# Altium schematic sheet DM3370_Connector_C.SchDoc: =project_title
size Tabloid; CompanyName: Luxonis Holding; Organization: Luxonis Holding; Address1: 1925 Harmony Park Drive; Address2: Westminster, CO; Address3: 80234; Address4: United States; DocumentNumber: 6; SheetNumber: 6; SheetTotal: 17
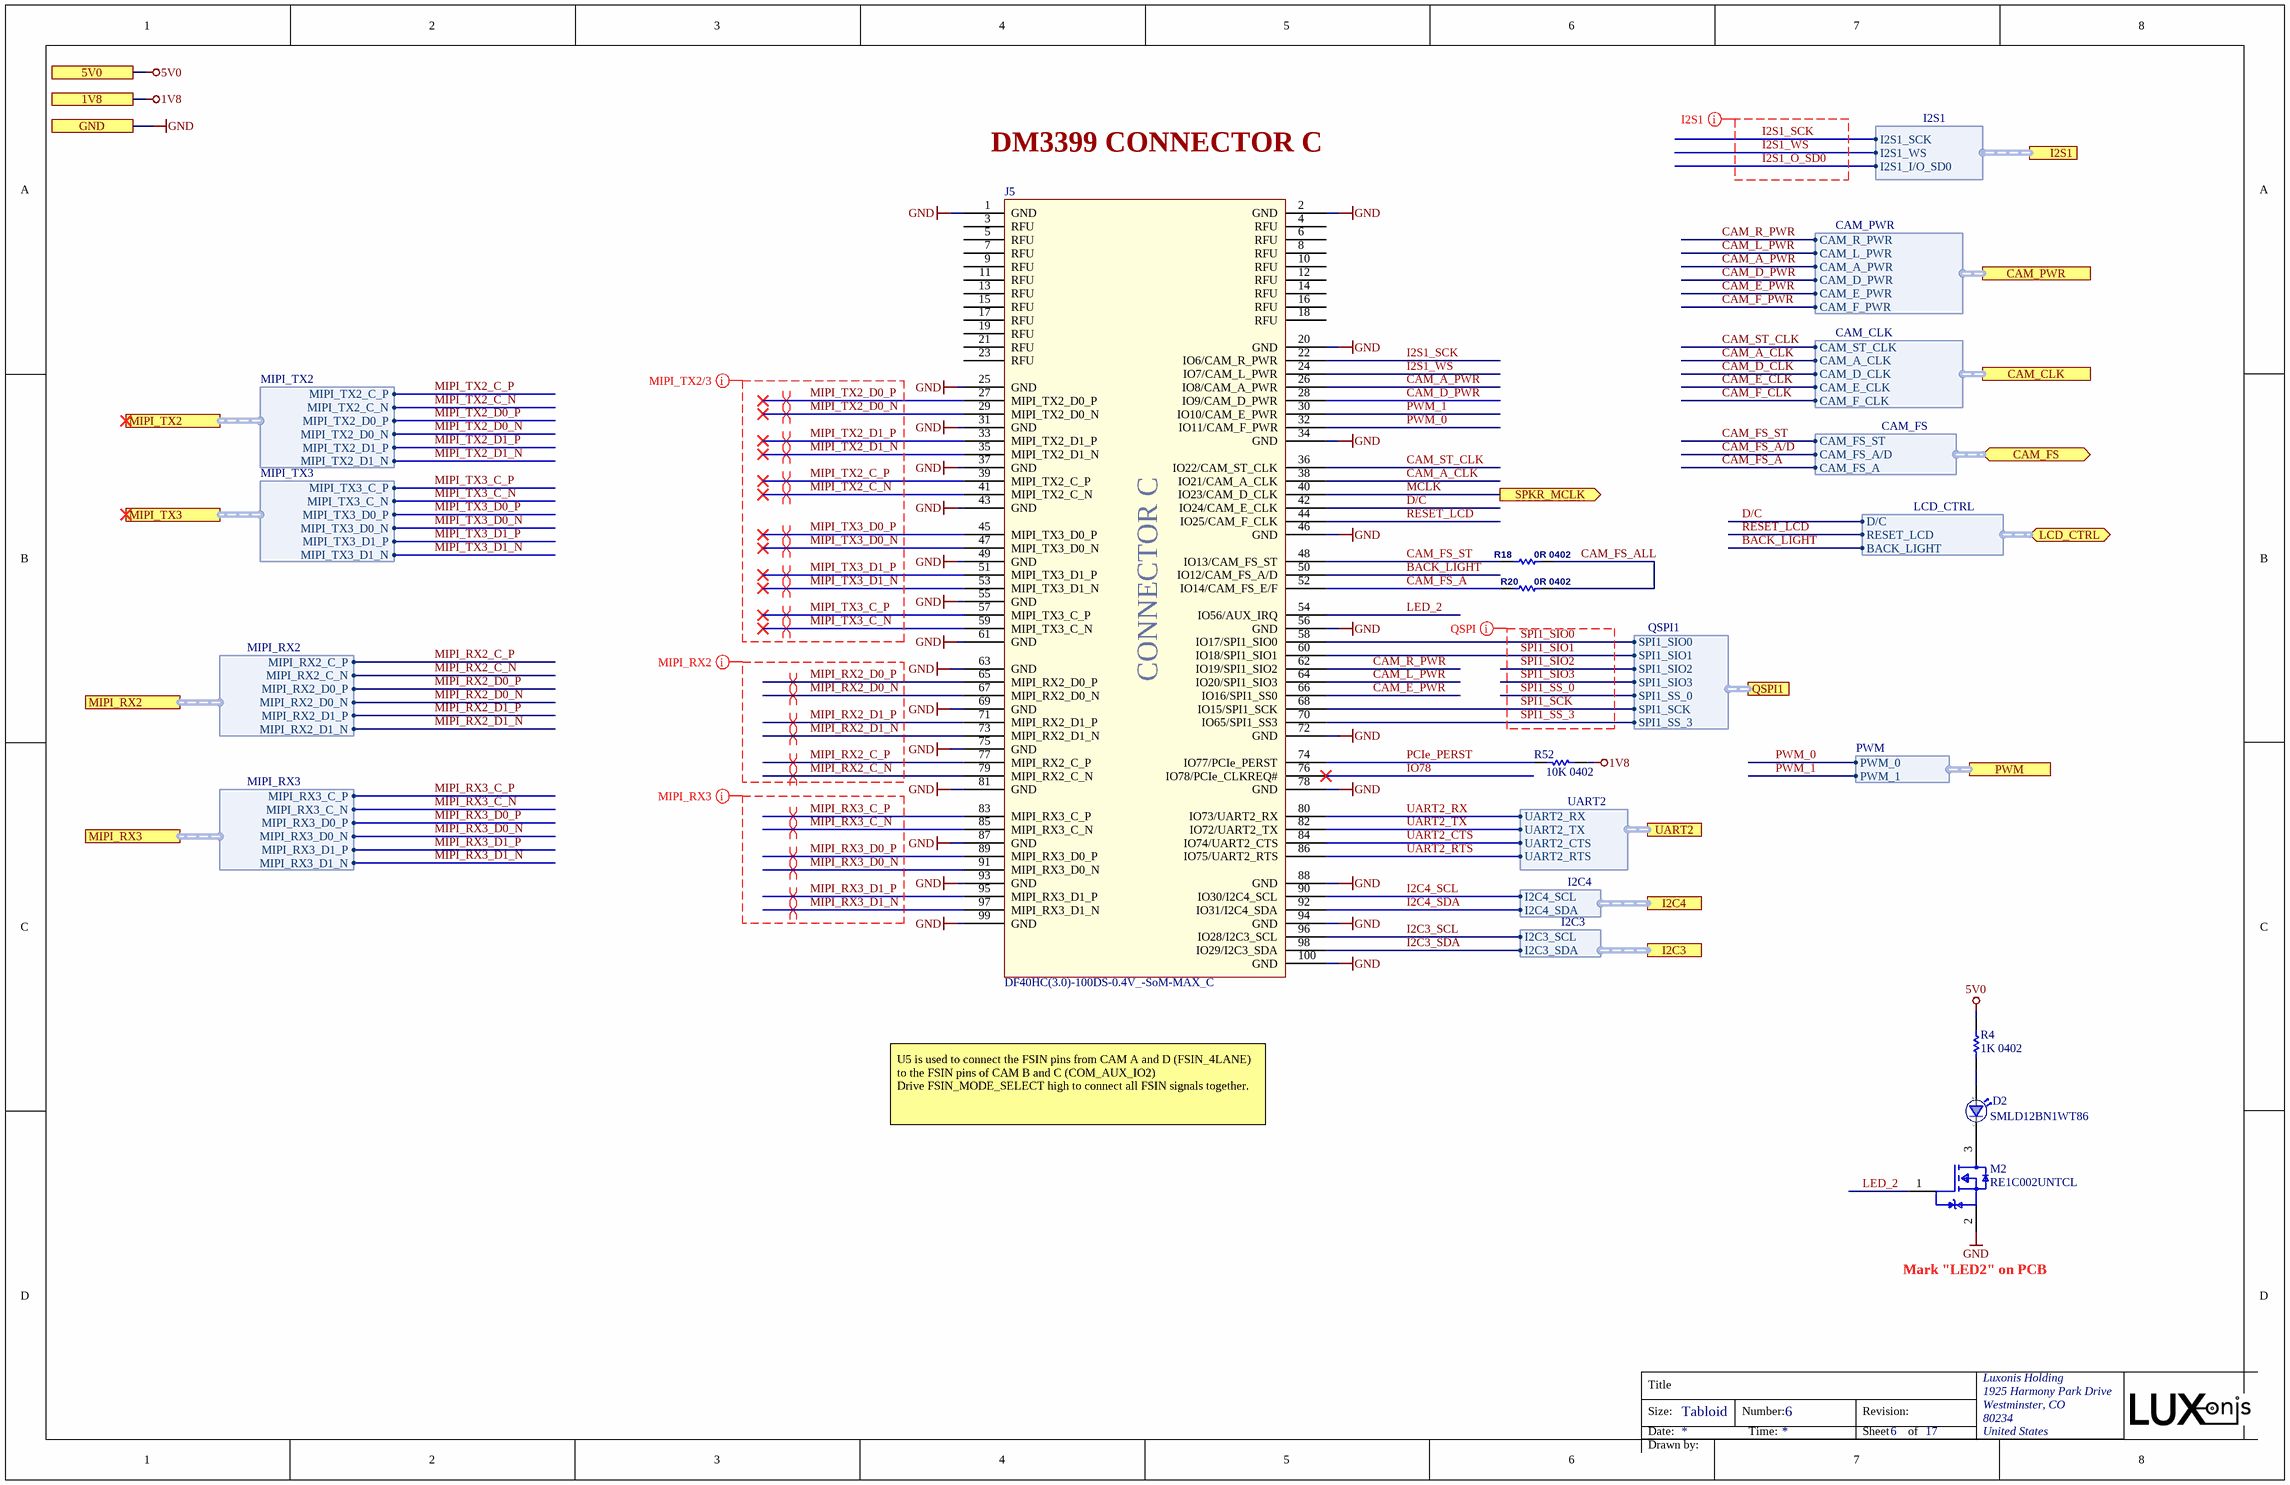
[diagram p0: DM3370_Connector_C.SchDoc]

## Parts
D2  Manufacturer Part Number 1: SMLD12BN1WT86  [SML_D1xx8W]  (hidden comment: CMP-008-000009-2)
J5  DF40HC(3.0)-100DS-0.4V_-SoM-MAX_C  [SOM_MAX_CONN_C_DF40HC-3.0-100DS-0.4V_minpad]
M2  RE1C002UNTCL  [RE1C002UNTCL]
R4  1K 0402  [RESC0402(1005)_L]
R18  0R 0402  [RESC0402(1005)_L]
R20  0R 0402  [RESC0402(1005)_L]
R52  10K 0402  [RESC0402(1005)_L]

## Ports
1V8, 5V0, CAM_CLK (harness CAM_CLK), CAM_FS (bidir, harness CAM_FS), CAM_PWR (harness CAM_PWR), GND, I2C3 (harness I2C3), I2C4 (harness I2C4), I2S1 (harness I2S1), LCD_CTRL (bidir, harness LCD_CTRL), MIPI_RX2 (harness MIPI_RX2), MIPI_RX3 (harness MIPI_RX3), MIPI_TX2 (harness MIPI_TX2), MIPI_TX3 (harness MIPI_TX3), PWM (harness PWM), QSPI1 (harness QSPI1), SPKR_MCLK (out), UART2 (harness UART2)

## Harnesses
MIPI_RX2: MIPI_RX2_C_P, MIPI_RX2_C_N, MIPI_RX2_D0_P, MIPI_RX2_D0_N, MIPI_RX2_D1_P, MIPI_RX2_D1_N
MIPI_RX3: MIPI_RX3_C_P, MIPI_RX3_C_N, MIPI_RX3_D0_P, MIPI_RX3_D0_N, MIPI_RX3_D1_P, MIPI_RX3_D1_N
I2C3: I2C3_SDA, I2C3_SCL
QSPI1: SPI1_SCK, SPI1_SIO0, SPI1_SIO1, SPI1_SIO2, SPI1_SIO3, SPI1_SS_0, SPI1_SS_3
MIPI_TX2: MIPI_TX2_C_P, MIPI_TX2_C_N, MIPI_TX2_D0_P, MIPI_TX2_D0_N, MIPI_TX2_D1_P, MIPI_TX2_D1_N
MIPI_TX3: MIPI_TX3_C_P, MIPI_TX3_C_N, MIPI_TX3_D0_P, MIPI_TX3_D0_N, MIPI_TX3_D1_P, MIPI_TX3_D1_N
UART2: UART2_TX, UART2_RX, UART2_CTS, UART2_RTS
I2C4: I2C4_SDA, I2C4_SCL
CAM_PWR: CAM_R_PWR, CAM_L_PWR, CAM_A_PWR, CAM_D_PWR, CAM_E_PWR, CAM_F_PWR
CAM_CLK: CAM_ST_CLK, CAM_A_CLK, CAM_D_CLK, CAM_E_CLK, CAM_F_CLK
CAM_FS: CAM_FS_ST, CAM_FS_A/D, CAM_FS_A
LCD_CTRL: RESET_LCD, D/C, BACK_LIGHT
PWM: PWM_0, PWM_1
I2S1: I2S1_SCK, I2S1_WS, I2S1_I/O_SD0

## Nets
1V8: R52.1 ; port 1V8
5V0: R4.2 ; port 5V0
GND: J5.1(GND) J5.2(GND) J5.20(GND) J5.25(GND) J5.31(GND) J5.34(GND) J5.37(GND) J5.43(GND) J5.46(GND) J5.49(GND) J5.55(GND) J5.56(GND) J5.61(GND) J5.63(GND) J5.69(GND) J5.72(GND) J5.75(GND) J5.78(GND) J5.81(GND) J5.87(GND) J5.88(GND) J5.93(GND) J5.94(GND) J5.99(GND) J5.100(GND) M2.2(Source) ; port GND
BACK_LIGHT: J5.50(IO12/CAM_FS_A/D) ; port LCD_CTRL.BACK_LIGHT
CAM_A_CLK: J5.38(IO21/CAM_A_CLK) ; port CAM_CLK.CAM_A_CLK
CAM_A_PWR: J5.26(IO8/CAM_A_PWR) ; port CAM_PWR.CAM_A_PWR
CAM_D_CLK: port CAM_CLK.CAM_D_CLK
CAM_D_PWR: J5.28(IO9/CAM_D_PWR) ; port CAM_PWR.CAM_D_PWR
CAM_E_CLK: port CAM_CLK.CAM_E_CLK
CAM_E_PWR: J5.66(IO16/SPI1_SS0) ; port CAM_PWR.CAM_E_PWR
CAM_F_CLK: port CAM_CLK.CAM_F_CLK
CAM_F_PWR: port CAM_PWR.CAM_F_PWR
CAM_FS_A: J5.52(IO14/CAM_FS_E/F) R20.2 ; port CAM_FS.CAM_FS_A
CAM_FS_A/D: port CAM_FS.CAM_FS_A/D
CAM_FS_ALL: R18.1 R20.1
CAM_FS_ST: J5.48(IO13/CAM_FS_ST) R18.2 ; port CAM_FS.CAM_FS_ST
CAM_L_PWR: J5.64(IO20/SPI1_SIO3) ; port CAM_PWR.CAM_L_PWR
CAM_R_PWR: J5.62(IO19/SPI1_SIO2) ; port CAM_PWR.CAM_R_PWR
CAM_ST_CLK: J5.36(IO22/CAM_ST_CLK) ; port CAM_CLK.CAM_ST_CLK
D/C: J5.42(IO24/CAM_E_CLK) ; port LCD_CTRL.D/C
I2C3_SCL: J5.96(IO28/I2C3_SCL) ; port I2C3.I2C3_SCL
I2C3_SDA: J5.98(IO29/I2C3_SDA) ; port I2C3.I2C3_SDA
I2C4_SCL: J5.90(IO30/I2C4_SCL) ; port I2C4.I2C4_SCL
I2C4_SDA: J5.92(IO31/I2C4_SDA) ; port I2C4.I2C4_SDA
I2S1_O_SD0: port I2S1.I2S1_I/O_SD0
I2S1_SCK: J5.22(IO6/CAM_R_PWR) ; port I2S1.I2S1_SCK
I2S1_WS: J5.24(IO7/CAM_L_PWR) ; port I2S1.I2S1_WS
IO78: J5.76(IO78/PCIe_CLKREQ#)
LED_2: J5.54(IO56/AUX_IRQ) M2.1(Gate)
MCLK: J5.40(IO23/CAM_D_CLK) ; port SPKR_MCLK
MIPI_RX2_C_N: J5.79(MIPI_RX2_C_N) ; port MIPI_RX2.MIPI_RX2_C_N
MIPI_RX2_C_P: J5.77(MIPI_RX2_C_P) ; port MIPI_RX2.MIPI_RX2_C_P
MIPI_RX2_D0_N: J5.67(MIPI_RX2_D0_N) ; port MIPI_RX2.MIPI_RX2_D0_N
MIPI_RX2_D0_P: J5.65(MIPI_RX2_D0_P) ; port MIPI_RX2.MIPI_RX2_D0_P
MIPI_RX2_D1_N: J5.73(MIPI_RX2_D1_N) ; port MIPI_RX2.MIPI_RX2_D1_N
MIPI_RX2_D1_P: J5.71(MIPI_RX2_D1_P) ; port MIPI_RX2.MIPI_RX2_D1_P
MIPI_RX3_C_N: J5.85(MIPI_RX3_C_N) ; port MIPI_RX3.MIPI_RX3_C_N
MIPI_RX3_C_P: J5.83(MIPI_RX3_C_P) ; port MIPI_RX3.MIPI_RX3_C_P
MIPI_RX3_D0_N: J5.91(MIPI_RX3_D0_N) ; port MIPI_RX3.MIPI_RX3_D0_N
MIPI_RX3_D0_P: J5.89(MIPI_RX3_D0_P) ; port MIPI_RX3.MIPI_RX3_D0_P
MIPI_RX3_D1_N: J5.97(MIPI_RX3_D1_N) ; port MIPI_RX3.MIPI_RX3_D1_N
MIPI_RX3_D1_P: J5.95(MIPI_RX3_D1_P) ; port MIPI_RX3.MIPI_RX3_D1_P
MIPI_TX2_C_N: J5.41(MIPI_TX2_C_N) ; port MIPI_TX2.MIPI_TX2_C_N
MIPI_TX2_C_P: J5.39(MIPI_TX2_C_P) ; port MIPI_TX2.MIPI_TX2_C_P
MIPI_TX2_D0_N: J5.29(MIPI_TX2_D0_N) ; port MIPI_TX2.MIPI_TX2_D0_N
MIPI_TX2_D0_P: J5.27(MIPI_TX2_D0_P) ; port MIPI_TX2.MIPI_TX2_D0_P
MIPI_TX2_D1_N: J5.35(MIPI_TX2_D1_N) ; port MIPI_TX2.MIPI_TX2_D1_N
MIPI_TX2_D1_P: J5.33(MIPI_TX2_D1_P) ; port MIPI_TX2.MIPI_TX2_D1_P
MIPI_TX3_C_N: J5.59(MIPI_TX3_C_N) ; port MIPI_TX3.MIPI_TX3_C_N
MIPI_TX3_C_P: J5.57(MIPI_TX3_C_P) ; port MIPI_TX3.MIPI_TX3_C_P
MIPI_TX3_D0_N: J5.47(MIPI_TX3_D0_N) ; port MIPI_TX3.MIPI_TX3_D0_N
MIPI_TX3_D0_P: J5.45(MIPI_TX3_D0_P) ; port MIPI_TX3.MIPI_TX3_D0_P
MIPI_TX3_D1_N: J5.53(MIPI_TX3_D1_N) ; port MIPI_TX3.MIPI_TX3_D1_N
MIPI_TX3_D1_P: J5.51(MIPI_TX3_D1_P) ; port MIPI_TX3.MIPI_TX3_D1_P
PCIe_PERST: J5.74(IO77/PCIe_PERST) R52.2
PWM_0: J5.32(IO11/CAM_F_PWR) ; port PWM.PWM_0
PWM_1: J5.30(IO10/CAM_E_PWR) ; port PWM.PWM_1
RESET_LCD: J5.44(IO25/CAM_F_CLK) ; port LCD_CTRL.RESET_LCD
SPI1_SCK: J5.68(IO15/SPI1_SCK) ; port QSPI1.SPI1_SCK
SPI1_SIO0: J5.58(IO17/SPI1_SIO0) ; port QSPI1.SPI1_SIO0
SPI1_SIO1: J5.60(IO18/SPI1_SIO1) ; port QSPI1.SPI1_SIO1
SPI1_SIO2: port QSPI1.SPI1_SIO2
SPI1_SIO3: port QSPI1.SPI1_SIO3
SPI1_SS_0: port QSPI1.SPI1_SS_0
SPI1_SS_3: J5.70(IO65/SPI1_SS3) ; port QSPI1.SPI1_SS_3
UART2_CTS: J5.84(IO74/UART2_CTS) ; port UART2.UART2_CTS
UART2_RTS: J5.86(IO75/UART2_RTS) ; port UART2.UART2_RTS
UART2_RX: J5.80(IO73/UART2_RX) ; port UART2.UART2_RX
UART2_TX: J5.82(IO72/UART2_TX) ; port UART2.UART2_TX
NetD2_1: D2.1(C) M2.3(Drain)
NetD2_2: D2.2(A) R4.1

Not connected (* = marked no-connect by the designer): J5 3(RFU) 4(RFU) 5(RFU) 6(RFU) 7(RFU) 8(RFU) 9(RFU) 10(RFU) 11(RFU) 12(RFU) 13(RFU) 14(RFU) 15(RFU) 16(RFU) 17(RFU) 18(RFU) 19(RFU) 21(RFU) 23(RFU)

## Layout directives
net class QSPI: SPI1_SCK, SPI1_SIO0, SPI1_SIO1, SPI1_SIO2, SPI1_SIO3, SPI1_SS_0, SPI1_SS_3
differential pair; differential pair class 100ohm: MIPI_RX2_C_N, MIPI_RX2_C_P, MIPI_RX2_D0_N, MIPI_RX2_D0_P, MIPI_RX2_D1_N, MIPI_RX2_D1_P, MIPI_RX3_C_N, MIPI_RX3_C_P, MIPI_RX3_D0_N, MIPI_RX3_D0_P, MIPI_RX3_D1_N, MIPI_RX3_D1_P, MIPI_TX2_C_N, MIPI_TX2_C_P, MIPI_TX2_D0_N, MIPI_TX2_D0_P, MIPI_TX2_D1_N, MIPI_TX2_D1_P, MIPI_TX3_C_N, MIPI_TX3_C_P, MIPI_TX3_D0_N, MIPI_TX3_D0_P, MIPI_TX3_D1_N, MIPI_TX3_D1_P
net class MIPI_TX2/3: MIPI_TX2_C_N, MIPI_TX2_C_P, MIPI_TX2_D0_N, MIPI_TX2_D0_P, MIPI_TX2_D1_N, MIPI_TX2_D1_P, MIPI_TX3_C_N, MIPI_TX3_C_P, MIPI_TX3_D0_N, MIPI_TX3_D0_P, MIPI_TX3_D1_N, MIPI_TX3_D1_P
net class MIPI_RX2: MIPI_RX2_C_N, MIPI_RX2_C_P, MIPI_RX2_D0_N, MIPI_RX2_D0_P, MIPI_RX2_D1_N, MIPI_RX2_D1_P
net class MIPI_RX3: MIPI_RX3_C_N, MIPI_RX3_C_P, MIPI_RX3_D0_N, MIPI_RX3_D0_P, MIPI_RX3_D1_N, MIPI_RX3_D1_P
net class I2S1: I2S1_O_SD0, I2S1_SCK, I2S1_WS

## Notes on the sheet
- DM3399 CONNECTOR C
- U5 is used to connect the FSIN pins from CAM A and D (FSIN_4LANE) to the FSIN pins of CAM B and C (COM_AUX_IO2)
  Drive FSIN_MODE_SELECT high to connect all FSIN signals together.
- Mark "LED2" on PCB
- Title
- Size:
- Date:
- Tabloid
- Number:
- Time:
- Revision:
- Sheet
- of
- Drawn by:
- (in symbol CMP-040-000002-3) CONNECTOR C

## Library data of the parts
D2 = CMP-008-000009-2: LED Uni-Color Blue 2-Pin Chip 0603(1608Metric) T/R; Manufacturer 1: Rohm; Category: LEDs
J5 = CMP-040-000002-3: OAK-SoM-MAX base board conn. C; Manufacturer Part Number 1: DF40HC(3.0)-100DS-0.4V(58); Manufacturer 1: Hirose; System: Connector; Connector Type: Receptacle; Number of Positions: 100; Pitch: 0.016inch; ComponentLink3URL: https://datasheet.ciiva.com/13559/ed-df40-20140305-13559540.pdf?src-supplier=Mouser; Packaging: Tape and Reel; Stock 1: 2172; Pricing 2: 1=2.50000, 10=2.40000, 25=2.10000, 50=2.10000, 100=2.00000, 250=1.76000, 500=1.71000, 1000=1.45000, 2000=1.36000, 5000=1.31000, 10000=1.31000 (USD); RoHS: Yes; ComponentLink2URL: https://datasheet.ciiva.com/18562/ed-df40-20140305-18562189.pdf?src-supplier=Digi-Key; Design Item ID: DF40HC(3.0)-100DS-0.4V_-SoM-MAX_C; Lead Free: Lead Free; Contact Plating: Gold; ComponentLink1Description: https://datasheet.ciiva.com/46636/ed-df40-20140305-46636517.pdf?src-supplier=Digi-Key; Stock 2: 2078; ComponentLink1URL: https://datasheet.ciiva.com/46636/ed-df40-20140305-46636517.pdf?src-supplier=Digi-Key; Pricing 1: 1=2.54000, 10=2.26000, 25=2.07000, 50=2.07000, 100=1.98000, 250=1.79000, 500=1.65000, 1000=1.41000, 3000=1.32000, 6000=1.23000, 10000=1.23000 (USD); ComponentLink4Description: https://datasheet.ciiva.com/18562/ed-df40-20140305-18562462.pdf?src-supplier=Digi-Key; Mount: Surface Mount; ComponentLink4URL: https://datasheet.ciiva.com/18562/ed-df40-20140305-18562462.pdf?src-supplier=Digi-Key; Package Quantity: 1000; Source: LuxonisMaster_nejc.SchLib; Number of Rows: 2; ComponentLink2Description: https://datasheet.ciiva.com/18562/ed-df40-20140305-18562189.pdf?src-supplier=Digi-Key; ComponentLink3Description: https://datasheet.ciiva.com/13559/ed-df40-20140305-13559540.pdf?src-supplier=Mouser
M2 = RE1C002UNTCL: MOSFET N-CH 20V 0.2A EMT3; Manufacturer 1: Rohm; Continuous Drain Current (ID): 200mA; Rds On Max: 1.2R; Input Capacitance: 25pF; Max Power Dissipation: 150mW; RoHS: Yes; Mount: Surface Mount; Case/Package: SOT-89; Packaging: Tape and Reel; Drain to Source Voltage (Vdss): 20V; Lead Free: Lead Free; ComponentLink1URL: http://www.mouser.com/ds/2/348/re1c002untcl-e-1018231.pdf?src-supplier=Mouser; ComponentLink1Description: http://www.mouser.com/ds/2/348/re1c002untcl-e-1018231.pdf?src-supplier=Mouser; ComponentLink2URL: http://rohmfs.rohm.com/en/techdata_basic/transistor/taping/EMT3_TL_taping.pdf?src-supplier=Digi-Key; ComponentLink2Description: http://rohmfs.rohm.com/en/techdata_basic/transistor/taping/EMT3_TL_taping.pdf?src-supplier=Digi-Key; ComponentLink3URL: http://rohmfs.rohm.com/en/products/databook/datasheet/discrete/transistor/mosfet/re1c002un.pdf?src-supplier=Avnet; ComponentLink3Description: http://rohmfs.rohm.com/en/products/databook/datasheet/discrete/transistor/mosfet/re1c002un.pdf?src-supplier=Avnet; ComponentLink4URL: https://www.rohm.com/datasheet/RE1C002UN/re1c002untcl-e?src-supplier=Digi-Key; ComponentLink4Description: https://www.rohm.com/datasheet/RE1C002UN/re1c002untcl-e?src-supplier=Digi-Key; ComponentLink5URL: http://www.farnell.com/datasheets/2704376.pdf?src-supplier=Newark; ComponentLink5Description: http://www.farnell.com/datasheets/2704376.pdf?src-supplier=Newark; ComponentLink6URL: http://www.farnell.com/datasheets/2704376.pdf?src-supplier=Farnell; ComponentLink6Description: http://www.farnell.com/datasheets/2704376.pdf?src-supplier=Farnell; ComponentLink7URL: http://www.farnell.com/datasheets/2704376.pdf?src-supplier=Element14; ComponentLink7Description: http://www.farnell.com/datasheets/2704376.pdf?src-supplier=Element14; Supplier 1: Digi-Key; Manufacturer Part Number 1: RE1C002UNTCL; Stock 1: 868886; Pricing 1: 1=0.20000, 10=0.18200, 100=0.09930, 500=0.06112, 1000=0.04167 (USD); Supplier Part Number 1: RE1C002UNTCLCT-ND
R4 = RC0402FR-071KL: RES SMD 1K OHM 1% 1/16W 0402 1 kOhms ±1% 0.063W, 1/16W Chip Resistor 0402 (1005 Metric) Moisture Resistant Thick Film; Manufacturer 1: Yageo; Temperature Coefficient: 100ppm/°C; Power Rating: 62.5mW; Voltage Rating (DC): 50V; Resistance: 1kR; RoHS: Yes; Number of Pins: 2; Case Code (Imperial): 0402; Case Code (Metric): 1005; Min Operating Temperature: -55°C; Max Operating Temperature: 155°C; Packaging: Tape and Reel; Composition: Thick Film; Voltage Rating: 50V; Military Standard: Not; Termination: SMD/SMT; Length: 1mm; Height: 0.32mm; Width: 0.5mm; Depth: 0.5mm; Lead Free: Lead Free; REACH SVHC: Unknown; ComponentLink1URL: https://datasheet.ciiva.com/11819/0900766b80c66297-11819477.pdf?src-supplier=RSComponents; ComponentLink1Description: https://datasheet.ciiva.com/11819/0900766b80c66297-11819477.pdf?src-supplier=RSComponents; ComponentLink2URL: https://datasheet.ciiva.com/12666/pyu-rc0402-51-rohs-l-6-r-12666741.pdf?src-supplier=Mouser; ComponentLink2Description: https://datasheet.ciiva.com/12666/pyu-rc0402-51-rohs-l-6-r-12666741.pdf?src-supplier=Mouser; ComponentLink3URL: https://datasheet.ciiva.com/17063/pyu-rc0402-51-rohs-l-6-r-17063193.pdf?src-supplier=Future+Electronics; ComponentLink3Description: https://datasheet.ciiva.com/17063/pyu-rc0402-51-rohs-l-6-r-17063193.pdf?src-supplier=Future+Electronics; ComponentLink4URL: https://datasheet.ciiva.com/22747/1018594-22747513.pdf?src-supplier=Element14; ComponentLink4Description: https://datasheet.ciiva.com/22747/1018594-22747513.pdf?src-supplier=Element14; ComponentLink5URL: https://datasheet.ciiva.com/7849/1018594-7849869.pdf?src-supplier=Element14; ComponentLink5Description: https://datasheet.ciiva.com/7849/1018594-7849869.pdf?src-supplier=Element14; ComponentLink6URL: https://datasheet.ciiva.com/7983/1018594-7983502.pdf?src-supplier=Element14; ComponentLink6Description: https://datasheet.ciiva.com/7983/1018594-7983502.pdf?src-supplier=Element14; ComponentLink7URL: https://datasheet.ciiva.com/7849/1018594-7849871.pdf?src-supplier=Element14; ComponentLink7Description: https://datasheet.ciiva.com/7849/1018594-7849871.pdf?src-supplier=Element14; Supplier 1: Digi-Key; Manufacturer Part Number 1: RC0402FR-071KL; Stock 1: 60695854; Pricing 1: 1=0.10000, 10=0.01600, 100=0.00670, 1000=0.00301, 2500=0.00261, 5000=0.00215 (USD); Case/Package: 0402; Tolerance: 1%; Supplier Part Number 1: 311-1.00KLRCT-ND
R18 R20 = CRCW04020000Z0ED: RES SMD 0 OHM JUMPER 1/16W 0402; Manufacturer 1: Vishay; Resistance: 0mR; Power Rating: 63mW; Voltage Rating: 50V; Temperature Coefficient: 100ppm/°C; Tolerance: 5%; Supplier 1: Digi-Key; Manufacturer Part Number 1: CRCW04020000Z0ED; Stock 1: 855968; Pricing 1: 1=0.10000, 10=0.03400, 25=0.02440, 50=0.01860, 100=0.01380, 250=0.01048, 500=0.00840, 1000=0.00618, 5000=0.00443 (USD); RoHS: Yes; Mount: Surface Mount; Case/Package: 0402; Weight: 2.3E-05oz; Case Code (Imperial): 0402; Case Code (Metric): 1005; Contact Plating: Tin; Min Operating Temperature: -55°C; Max Operating Temperature: 155°C; Packaging: Tape and Reel; Composition: Thick Film; Voltage Rating (DC): 50V; Package Quantity: 1; Termination: SMD/SMT; Number of Terminations: 2; Military Standard: Not; Max Power Dissipation: 63mW; Features: Automotive AEC-Q200; Length: 1mm; Height: 0.35mm; Width: 0.5mm; Depth: 0.5mm; Radiation Hardening: No; REACH SVHC: Unknown; Lead Free: Lead Free; ComponentLink1URL: https://datasheet.ciiva.com/3255/dcrcwe3-3255944.pdf?src-supplier=Avnet; ComponentLink1Description: https://datasheet.ciiva.com/3255/dcrcwe3-3255944.pdf?src-supplier=Avnet; ComponentLink2URL: https://datasheet.ciiva.com/3255/dcrcwe3-3255945.pdf?src-supplier=Avnet; ComponentLink2Description: https://datasheet.ciiva.com/3255/dcrcwe3-3255945.pdf?src-supplier=Avnet; ComponentLink3URL: https://datasheet.ciiva.com/16881/dcrcwe3-16881413.pdf?src-supplier=Avnet+Europe; ComponentLink3Description: https://datasheet.ciiva.com/16881/dcrcwe3-16881413.pdf?src-supplier=Avnet+Europe; ComponentLink4URL: https://datasheet.ciiva.com/2461/dcrcwe3-2461962.pdf?src-supplier=Digi-Key; ComponentLink4Description: https://datasheet.ciiva.com/2461/dcrcwe3-2461962.pdf?src-supplier=Digi-Key; ComponentLink5URL: https://datasheet.ciiva.com/7841/1720486-7841802.pdf?src-supplier=Element14; ComponentLink5Description: https://datasheet.ciiva.com/7841/1720486-7841802.pdf?src-supplier=Element14; ComponentLink6URL: https://datasheet.ciiva.com/2461/dcrcwe3-2461963.pdf?src-supplier=Digi-Key; ComponentLink6Description: https://datasheet.ciiva.com/2461/dcrcwe3-2461963.pdf?src-supplier=Digi-Key; ComponentLink7URL: https://datasheet.ciiva.com/2461/dcrcwe3-2461964.pdf?src-supplier=Digi-Key; ComponentLink7Description: https://datasheet.ciiva.com/2461/dcrcwe3-2461964.pdf?src-supplier=Digi-Key; ComponentLink8URL: https://datasheet.ciiva.com/7841/1697337-7841468.pdf?src-supplier=Element14; ComponentLink8Description: https://datasheet.ciiva.com/7841/1697337-7841468.pdf?src-supplier=Element14; ComponentLink9URL: https://datasheet.ciiva.com/16761/70200976-16761309.pdf?src-supplier=Allied+Electronics; ComponentLink9Description: https://datasheet.ciiva.com/16761/70200976-16761309.pdf?src-supplier=Allied+Electronics; ComponentLink10URL: https://datasheet.ciiva.com/26311/fld-crcw-e3-data-en-26311550.pdf?src-supplier=Distrelec; ComponentLink10Description: https://datasheet.ciiva.com/26311/fld-crcw-e3-data-en-26311550.pdf?src-supplier=Distrelec; Supplier Part Number 1: 541-0.0JCT-ND
R52 = RC0402FR-1310KL: RES SMD 10K OHM 1% 0402 1/16W Chip Resistor, 0402 [1005 Metric], 10 kohm, RC Series, 50 V, Thick Film, 62.5 mW; Manufacturer 1: Yageo; Resistance: 10kR; Temperature Coefficient: 100ppm/°C; Power Rating: 62.5mW; Voltage Rating: 50V; ComponentLink1URL: https://datasheet.ciiva.com/16940/pyu-rc0402-51-rohs-l-6-16940293.pdf?src-supplier=Avnet+Europe; ComponentLink1Description: https://datasheet.ciiva.com/16940/pyu-rc0402-51-rohs-l-6-16940293.pdf?src-supplier=Avnet+Europe; ComponentLink2URL: https://datasheet.ciiva.com/28386/pyu-rc0402-51-rohs-l-6-28386855.pdf?src-supplier=Avnet+Europe; ComponentLink2Description: https://datasheet.ciiva.com/28386/pyu-rc0402-51-rohs-l-6-28386855.pdf?src-supplier=Avnet+Europe; ComponentLink3URL: https://datasheet.ciiva.com/16740/pyu-rc0402-51-rohs-l-6-r-16740602.pdf?src-supplier=Future+Electronics; ComponentLink3Description: https://datasheet.ciiva.com/16740/pyu-rc0402-51-rohs-l-6-r-16740602.pdf?src-supplier=Future+Electronics; ComponentLink4URL: https://datasheet.ciiva.com/8891/pyu-rc0402-51-rohs-l-6-8891339.pdf?src-supplier=Avnet; ComponentLink4Description: https://datasheet.ciiva.com/8891/pyu-rc0402-51-rohs-l-6-8891339.pdf?src-supplier=Avnet; ComponentLink5URL: https://datasheet.ciiva.com/5557/pyu-rc0402-51-rohs-l-6-r-5557997.pdf?src-supplier=Mouser; ComponentLink5Description: https://datasheet.ciiva.com/5557/pyu-rc0402-51-rohs-l-6-r-5557997.pdf?src-supplier=Mouser; ComponentLink6URL: https://datasheet.ciiva.com/7983/1018594-7983533.pdf?src-supplier=Element14; ComponentLink6Description: https://datasheet.ciiva.com/7983/1018594-7983533.pdf?src-supplier=Element14; Supplier 1: Newark; Manufacturer Part Number 1: RC0402FR-1310KL; Stock 1: 62239; Pricing 1: 1=0.10000, 25=0.01200, 100=0.00400, 250=0.00400, 500=0.00300, 1000=0.00300 (USD); RoHS: Yes; Case/Package: 0402; Number of Pins: 2; Contact Plating: Tin,Matte,Lead; Case Code (Imperial): 0402; Case Code (Metric): 1005; Min Operating Temperature: -55°C; Max Operating Temperature: 155°C; Tolerance: 1%; Composition: Thick Film; Packaging: Tape and Reel; Termination: SMD/SMT; Military Standard: Not; Voltage Rating (DC): 50V; Working Voltage: 50V; Number of Terminations: 2; Length: 1mm; Depth: 0.5mm; Radiation Hardening: No; REACH SVHC: No SVHC; Lead Free: Lead Free; Supplier Part Number 1: 67R9960